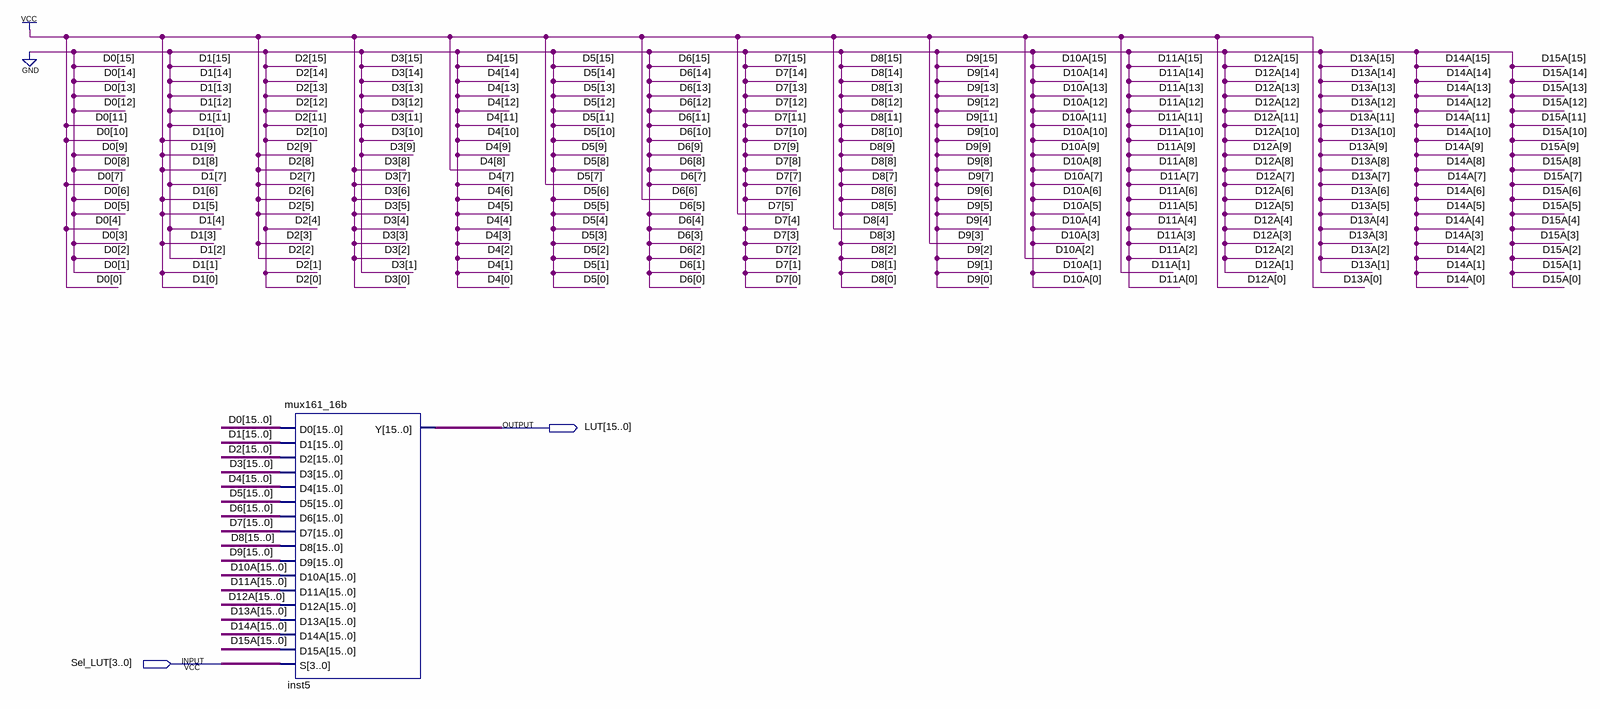
[diagram p0: schematic sheet]
// Quartus schematic LUT.bdf as structural Verilog: 1 symbols, 2 pins
module LUT (
  input  [3:0] Sel_LUT,
  output [15:0] LUT
);

  mux161_16b inst5 (
    .D0(16'b0000110010010001), .D1(16'b0000011101101011), .D2(16'b0000001111101100),
    .D3(16'b0000000111111101), .D4(16'b0000000100000000), .D5(16'b0000000010000000),
    .D6(16'b0000000001000000), .D7(16'b0000000000100000), .D8(16'b0000000000010000),
    .D9(16'b0000000000001000), .D10A(16'b0000000000000100), .D11A(16'b0000000000000010),
    .D12A(16'b0000000000000001), .D13A(16'b0000000000000001), .D14A({16{1'b0}}), .D15A({16{1'b0}}),
    .S(Sel_LUT), .Y(LUT));
endmodule
